# EAGLE design auto (EAGLE 9.2.2)
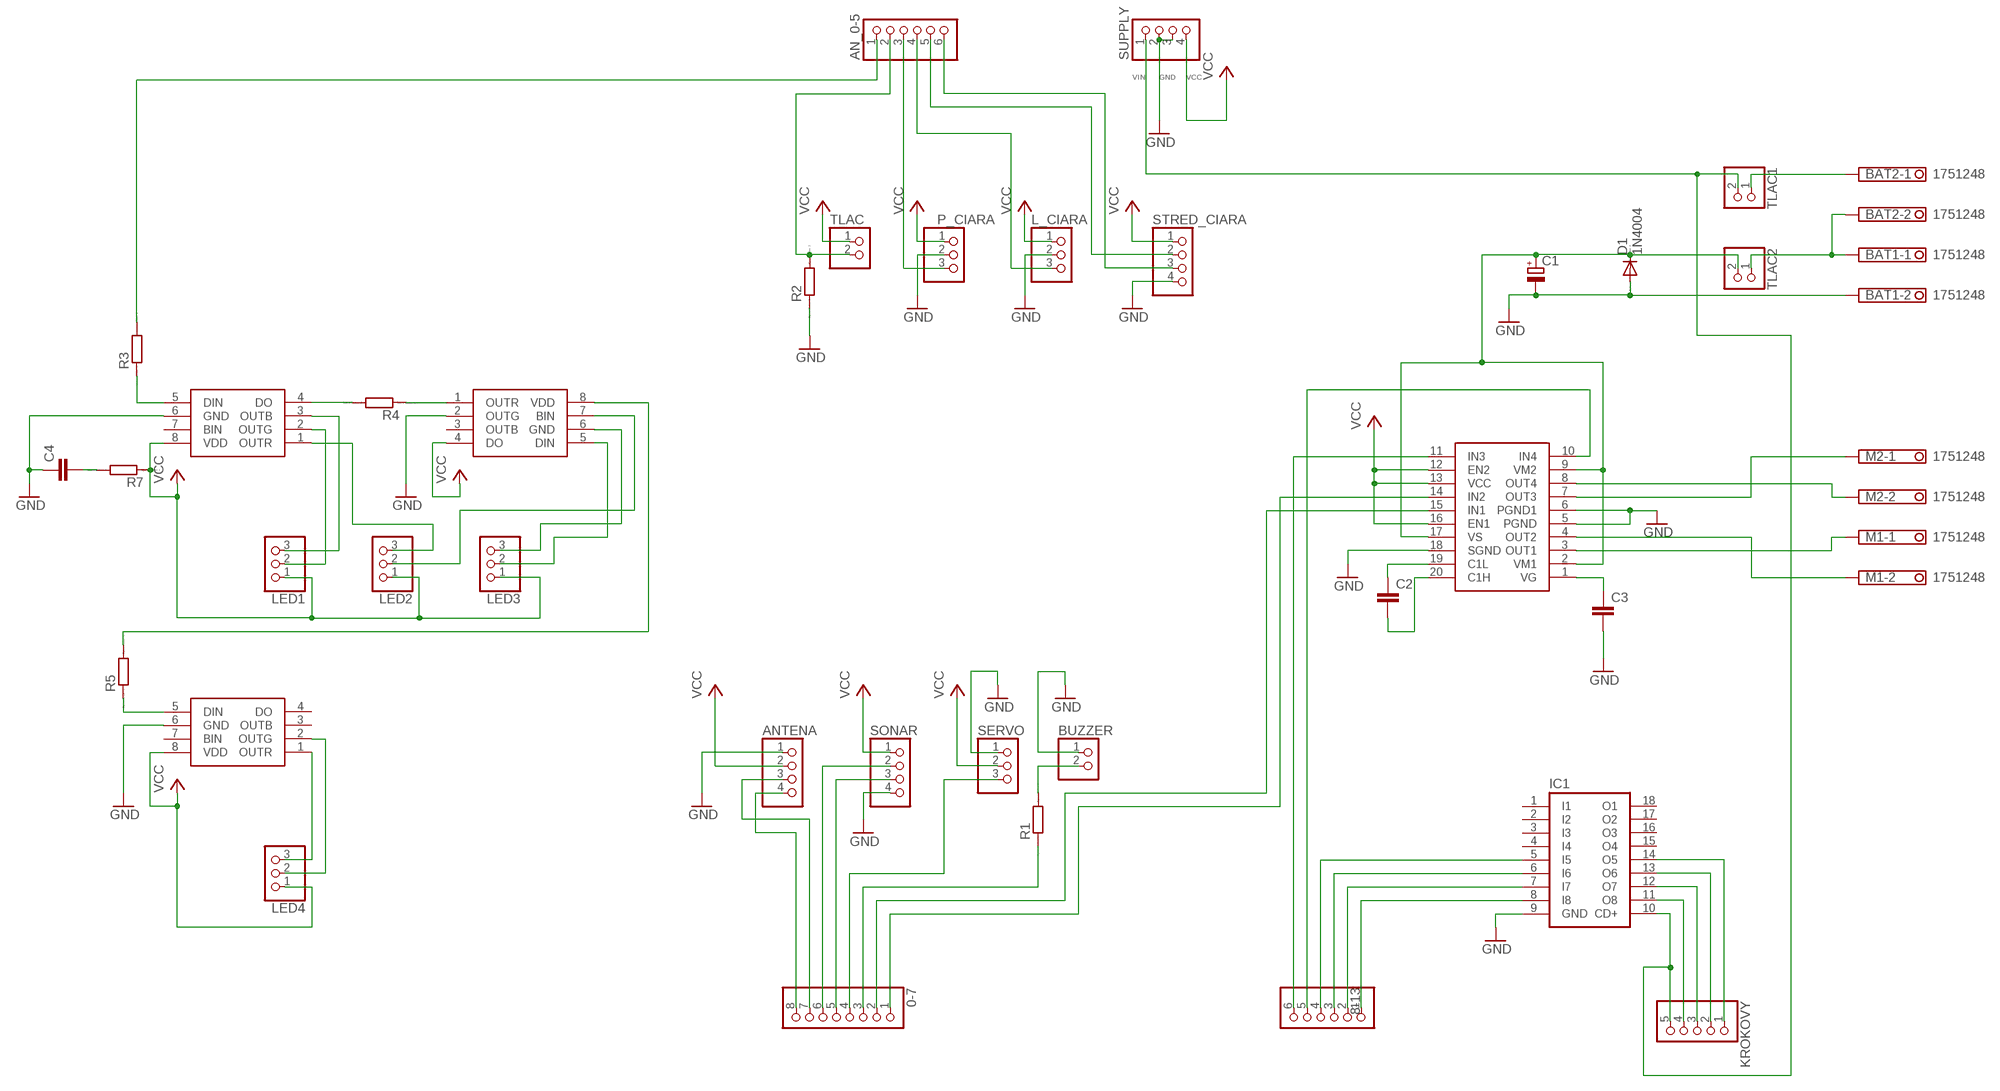
[diagram p0: schematic, sheet 1]

## Parts
0-7  PINHD-1X8  [1X08]
8-13  PINHD-1X6  [1X06]
AN_0-5  PINHD-1X6  [1X06]
ANTENA  PINHD-1X4  [1X04]
BAT1  1751248  [1751248]
BAT2  1751248  [1751248]
BUZZER  PINHD-1X2  [1X02]
C1  CPOL-EUE3.5-8  [E3,5-8]
C2  C-EU050-024X044  [C050-024X044]
C3  C-EU050-024X044  [C050-024X044]
C4  C-EU050-024X044  [C050-024X044]
D1  1N4004  [DO41-10]
IC1  ULN2804A  [DIL18]
KROKOVY  PINHD-1X5  [1X05]
L_CIARA  PINHD-1X3  [1X03]
LED1  PINHD-1X3  [1X03]
LED2  PINHD-1X3  [1X03]
LED3  PINHD-1X3  [1X03]
LED4  PINHD-1X3  [1X03]
M1  1751248  [1751248]
M2  1751248  [1751248]
P_CIARA  PINHD-1X3  [1X03]
R1  R0207/10  [0207/10]
R2  R0207/10  [0207/10]
R3  R0207/10  [0207/10]
R4  R0207/10  [0207/10]
R5  R0207/10  [0207/10]
R7  R0207/10  [0207/10]
SERVO  PINHD-1X3  [1X03]
SONAR  PINHD-1X4  [1X04]
STRED_CIARA  PINHD-1X4  [1X04]
SUPPLY  PINHD-1X4  [1X04]
TLAC  PINHD-1X2  [1X02]
TLAC1  PINHD-1X2  [1X02]
TLAC2  PINHD-1X2  [1X02]
U$1  LV8406  [TSSOP20]
U$2  WS2518B  [SOP08]
U$3  WS2518B  [SOP08]
U$4  WS2518B  [SOP08]

## Nets
GND: ANTENA.1 BAT1.2 BUZZER.1 C1.- C3.2 C4.1 D1.A IC1.9(GND) L_CIARA.2 P_CIARA.2 R2.1 SERVO.1 SONAR.4 STRED_CIARA.4 SUPPLY.2 SUPPLY.3 U$1.5(PGND) U$1.6(PGND1) U$1.18(SGND) U$2.6(GND) U$3.2(OUTG) U$4.6(GND)
N$1: AN_0-5.6 STRED_CIARA.3
N$2: AN_0-5.5 STRED_CIARA.2
N$3: AN_0-5.4 L_CIARA.3
N$4: AN_0-5.3 P_CIARA.3
N$5: 0-7.6 SONAR.2
N$6: 0-7.5 SONAR.3
N$7: 0-7.4 SERVO.3
N$8: C3.1 U$1.1(VG)
N$9: BAT1.1 BAT2.2 TLAC2.1
N$10: BUZZER.2 R1.2
N$11: 0-7.3 R1.1
N$12: BAT2.1 TLAC1.1
N$13: 8-13.4 IC1.5(I5)
N$14: 8-13.3 IC1.6(I6)
N$15: 8-13.2 IC1.7(I7)
N$16: 8-13.1 IC1.8(I8)
N$17: M1.1 U$1.3(OUT1)
N$18: IC1.11(O8) KROKOVY.4
N$19: IC1.12(O7) KROKOVY.3
N$20: IC1.14(O5) KROKOVY.1
N$21: IC1.13(O6) KROKOVY.2
N$22: M1.2 U$1.4(OUT2)
N$23: M2.1 U$1.7(OUT3)
N$24: M2.2 U$1.8(OUT4)
N$25: C1.+ D1.C TLAC2.2 U$1.2(VM1) U$1.9(VM2) U$1.17(VS)
N$26: 8-13.5 U$1.10(IN4)
N$27: 8-13.6 U$1.11(IN3)
N$28: C2.1 U$1.19(C1L)
N$29: C2.2 U$1.20(C1H)
N$30: R5.1 U$4.5(DIN)
N$31: LED4.3 U$4.1(OUTR)
N$32: 0-7.1 U$1.14(IN2)
N$33: R5.2 U$3.8(VDD)
N$34: AN_0-5.1 R3.2
N$35: LED2.2 U$3.7(BIN)
N$36: LED1.3 U$2.3(OUTB)
N$37: LED4.2 U$4.2(OUTG)
N$39: R4.1 U$3.1(OUTR)
N$40: R3.1 U$2.5(DIN)
N$41: LED3.3 U$3.6(GND)
N$42: LED3.2 U$3.5(DIN)
N$43: AN_0-5.2 R2.2 TLAC.2
N$46: 0-7.2 U$1.15(IN1)
N$47: LED1.2 U$2.2(OUTG)
N$48: 0-7.7 ANTENA.3
N$49: 0-7.8 ANTENA.4
N$50: R4.2 U$2.4(DO)
N$51: LED2.3 U$2.1(OUTR)
N$53: C4.2 R7.2
VCC: ANTENA.2 L_CIARA.1 LED1.1 LED2.1 LED3.1 LED4.1 P_CIARA.1 R7.1 SERVO.2 SONAR.1 STRED_CIARA.1 SUPPLY.4 TLAC.1 U$1.12(EN2) U$1.13(VCC) U$1.16(EN1) U$2.8(VDD) U$3.4(DO) U$4.8(VDD)
VIN: IC1.10(CD+) KROKOVY.5 SUPPLY.1 TLAC1.2
Unconnected: IC1.1(I1) IC1.2(I2) IC1.3(I3) IC1.4(I4) IC1.15(O4) IC1.16(O3) IC1.17(O2) IC1.18(O1) U$2.7(BIN) U$3.3(OUTB) U$4.3(OUTB) U$4.4(DO) U$4.7(BIN)

## Library data of the parts
0-7 = pinhead:PINHD-1X8: PIN HEADER
8-13 AN_0-5 = pinhead:PINHD-1X6: PIN HEADER
ANTENA SONAR STRED_CIARA SUPPLY = pinhead:PINHD-1X4: PIN HEADER
BAT1 BAT2 M1 M2 = con-phoenix-350:1751248: MKDS 1/ 2-3,5 Printklemme Nennstrom: 10 A Bemessungsspannung: 160 V Raster: 3,5 mm Polzahl: 2 Montageart: Löten Anschlussart: Schraubanschluss Anschlussrichtung vom Leiter zur Platine: 0° Source: http://eshop.phoenixcontact.com .. 1751248.pdf; OC_FARNELL: unknown; OC_NEWARK: unknown
BUZZER TLAC TLAC1 TLAC2 = pinhead:PINHD-1X2: PIN HEADER
C1 = rcl:CPOL-EU: POLARIZED CAPACITOR, European symbol; SPICEPREFIX: C
C2-C4 = rcl:C-EU: CAPACITOR, European symbol; SPICEPREFIX: C
D1 = diode:1N4004: DIODE general purpose rectifier, 1 A
IC1 = uln-udn:ULN2804A: DRIVER ARRAY
KROKOVY = pinhead:PINHD-1X5: PIN HEADER
L_CIARA LED1-LED4 P_CIARA SERVO = pinhead:PINHD-1X3: PIN HEADER
R1-R5 R7 = eagle-ltspice:R: RESISTOR, European symbol; SPICEMODEL: NONE; SPICEPREFIX: R
U$1 = LV8406:LV8406
U$2-U$4 = WS2518B:WS2518B

## Board
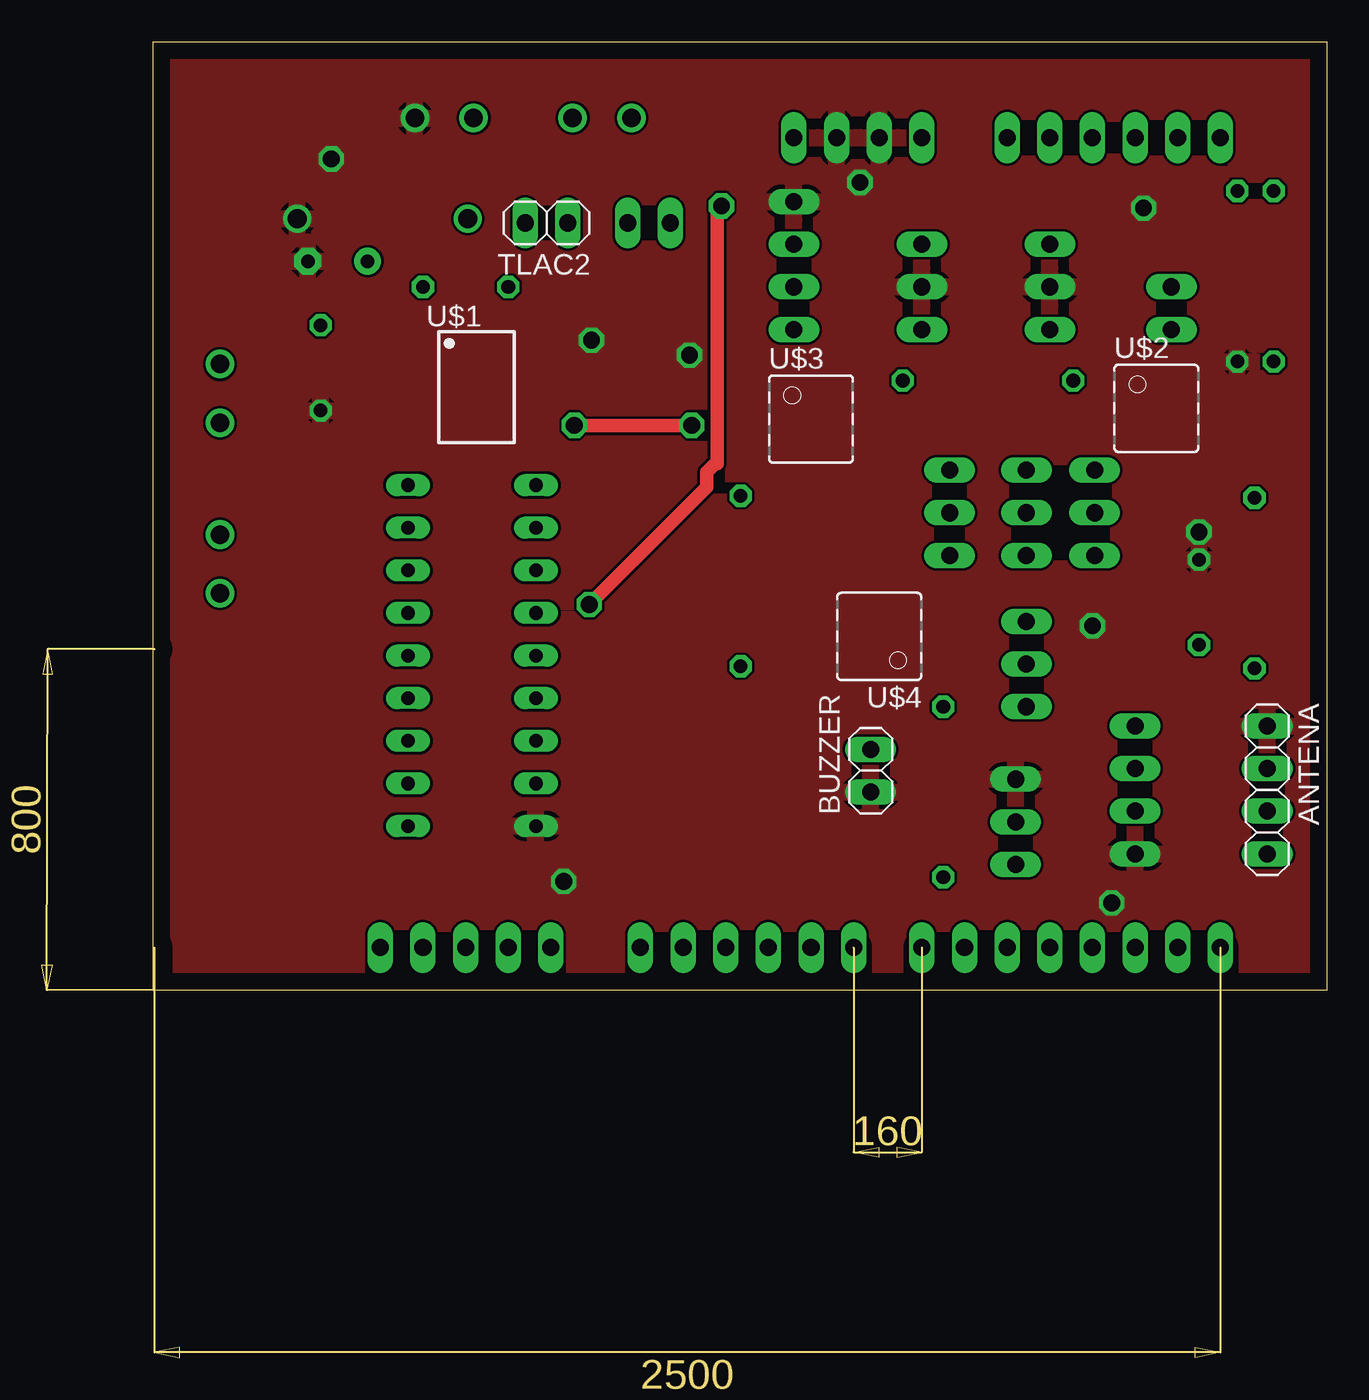
[diagram p1: board, top side]
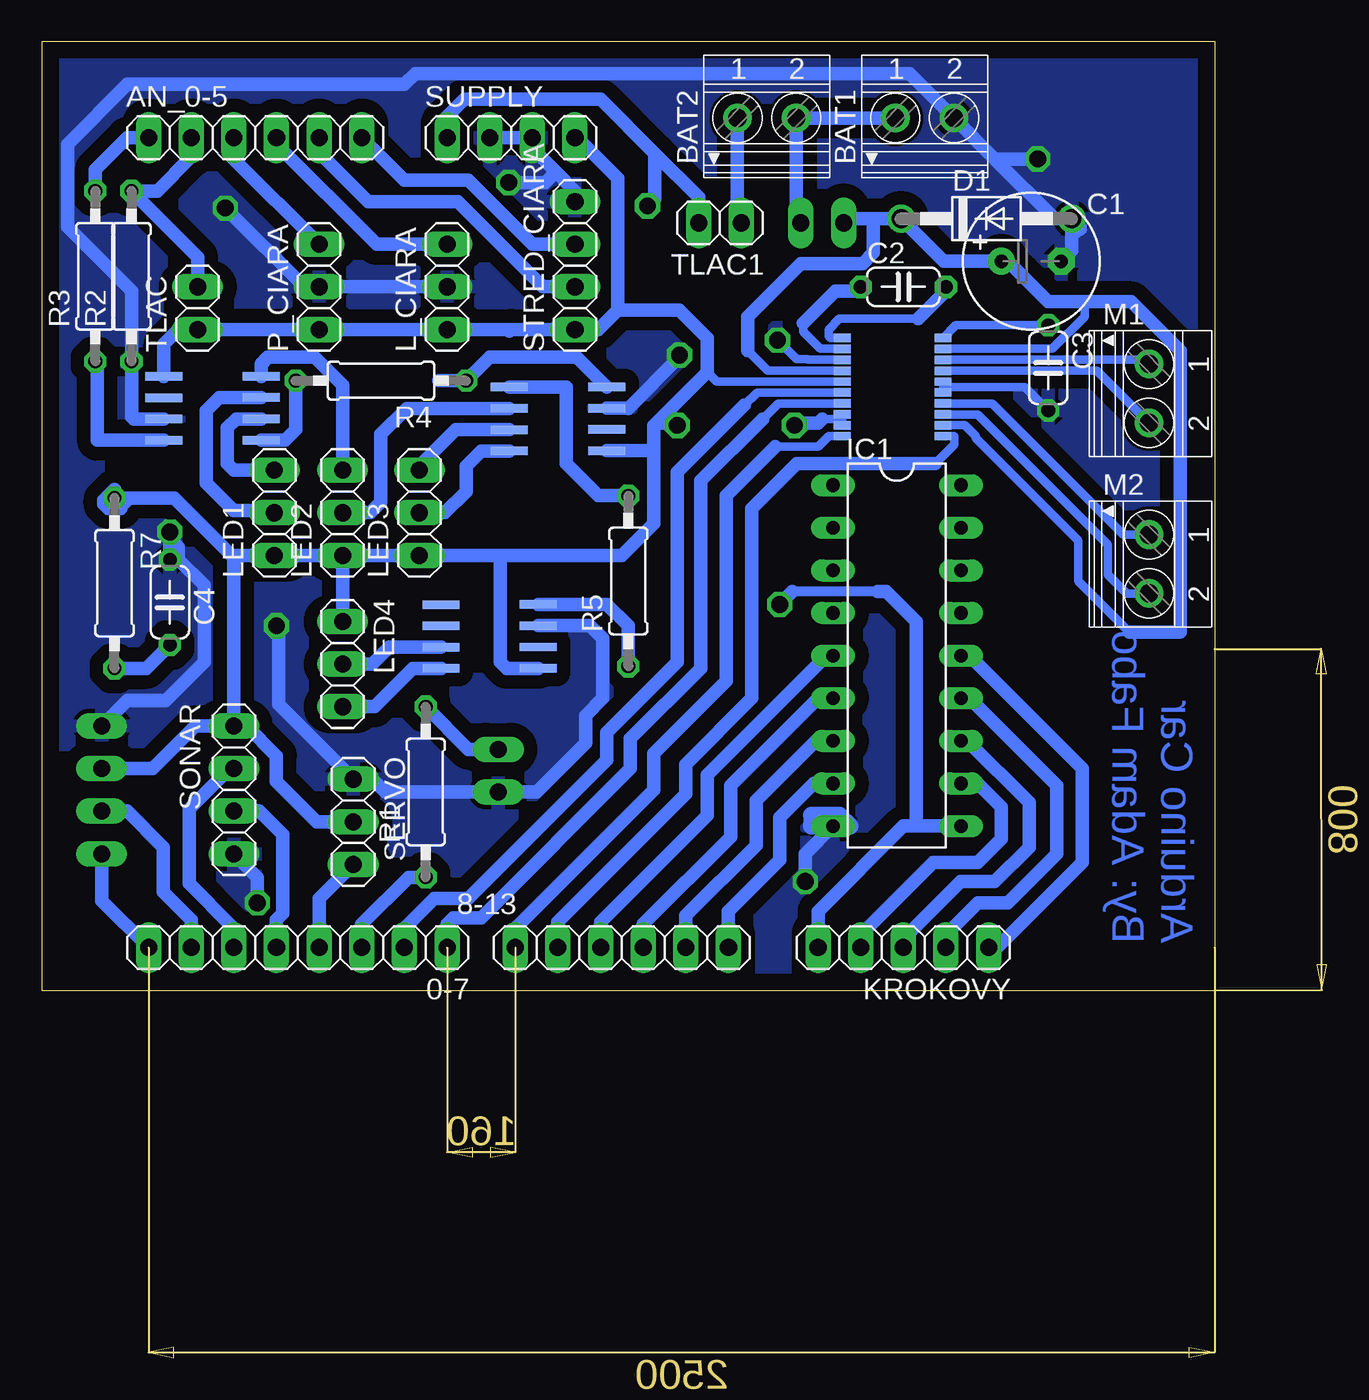
[diagram p2: board, bottom side, seen from below]

Size 69.9 x 56.51 mm. Coordinates in mm from the lower left corner, seen from the top.
Outline: 69.9,0 0,0 0,56.51 69.9,56.51 69.9,0
Copper layers (1*16): Top 0.035mm / dielectric 1.5mm / Bottom 0.035mm
Design rules "default": minimum track width 6mil, minimum drill 0.35mm, track to track 6mil, track to pad 6mil, pad to pad 6mil, via to via 6mil, smd to smd 6mil, copper to edge 40mil, drill to drill 6mil, minimum pad ring 10mil, minimum via ring 8mil, stop-mask expansion 4mil, vias tented up to drill 0mil, thermal gap 10mil

### Footprints (pad centres in the part's own frame; a part is rotated, then mirrored left to right if it is on the bottom)
1X08 = drill 1.016 long: 1 -8.89,0; 2 -6.35,0; 3 -3.81,0; 4 -1.27,0; 5 1.27,0; 6 3.81,0; 7 6.35,0; 8 8.89,0
1X06 = drill 1.016 long: 1 -6.35,0; 2 -3.81,0; 3 -1.27,0; 4 1.27,0; 5 3.81,0; 6 6.35,0
1X04 = drill 1.016 long: 1 -3.81,0; 2 -1.27,0; 3 1.27,0; 4 3.81,0
1751248 = drill 1.1 pad 1.7: 1 -1.75,-0.1; 2 1.75,-0.1
1X02 = drill 1.016 long: 1 -1.27,0; 2 1.27,0
E3,5-8 = drill 0.813 pad 1.6: + -1.778,0 | drill 0.813 pad 1.6 octagon: - 1.778,0
C050-024X044 = drill 0.813 octagon: 1 -2.54,0; 2 2.54,0
DO41-10 = drill 1.118: A 5.08,0; C -5.08,0
DIL18 = drill 0.813 long: 1 -10.16,-3.81; 2 -7.62,-3.81; 3 -5.08,-3.81; 4 -2.54,-3.81; 5 0,-3.81; 6 2.54,-3.81; 7 5.08,-3.81; 8 7.62,-3.81; 9 10.16,-3.81; 10 10.16,3.81; 11 7.62,3.81; 12 5.08,3.81; 13 2.54,3.81; 14 0,3.81; 15 -2.54,3.81; 16 -5.08,3.81; 17 -7.62,3.81; 18 -10.16,3.81
1X05 = drill 1.016 long: 1 -5.08,0; 2 -2.54,0; 3 0,0; 4 2.54,0; 5 5.08,0
1X03 = drill 1.016 long: 1 -2.54,0; 2 0,0; 3 2.54,0
0207/10 = drill 0.813 octagon: 1 -5.08,0; 2 5.08,0
TSSOP20 = smd 0.5 x 1 bottom: 1 -2.925,-3; 2 -2.275,-3; 3 -1.625,-3; 4 -0.975,-3; 5 -0.325,-3; 6 0.325,-3; 7 0.975,-3; 8 1.625,-3; 9 2.275,-3; 10 2.925,-3; 11 2.925,3; 12 2.275,3; 13 1.625,3; 14 0.975,3; 15 0.325,3; 16 -0.325,3; 17 -0.975,3; 18 -1.625,3; 19 -2.275,3; 20 -2.925,3
SOP08 = smd 0.5 x 2.2 bottom: 1 -1.905,-2.9; 2 -0.645,-2.9; 3 0.625,-2.9; 4 1.895,-2.9; 5 1.905,2.9; 6 0.635,2.9; 7 -0.635,2.9; 8 -1.905,2.9

### Placement (x,y rotation side)
0-7  54.66,2.54 180 bottom
8-13  35.36,2.54 180 bottom
AN_0-5  57.2,50.8 0 bottom
ANTENA  66.35,11.94 270 top
BAT1  17.32,52.07 0 bottom
BAT2  26.72,52.07 0 bottom
BUZZER  42.72,13.08 90 top
C1  10.97,43.43 0 bottom
C2  18.59,41.91 0 bottom
C3  9.96,37.08 270 bottom
C4  62.28,23.11 270 bottom
D1  13.64,45.97 0 bottom
IC1  18.97,19.94 270 bottom
KROKOVY  18.59,2.54 180 bottom
L_CIARA  45.77,41.91 90 bottom
LED1  56.06,28.45 90 bottom
LED2  51.99,28.45 90 bottom
LED3  47.42,28.45 90 bottom
LED4  51.99,19.43 270 bottom
M1  3.86,35.56 270 bottom
M2  3.86,25.4 270 bottom
P_CIARA  53.39,41.91 90 bottom
R1  47.04,11.81 90 bottom
R2  64.57,42.55 90 bottom
R3  66.73,42.55 90 bottom
R4  49.71,36.32 180 bottom
R5  34.98,24.38 90 bottom
R7  65.58,24.26 270 bottom
SERVO  51.36,10.03 270 bottom
SONAR  58.47,11.94 270 bottom
STRED_CIARA  38.15,43.18 90 bottom
SUPPLY  41.96,50.8 0 bottom
TLAC  60.63,40.64 90 bottom
TLAC1  29.52,45.72 180 bottom
TLAC2  23.42,45.72 180 top
U$1  19.23,35.94 270 top
U$2  59.74,34.67 270 top
U$3  39.17,34.04 270 top
U$4  43.23,21.08 90 top

### Tracks (layer width: path | path; a pad name or v marks a point on that pad's centre or on a via)
GND  (via drill 1 pad 0.75)
  Bottom 0.508: U$1.6 16.23,35.94 | 16.23,35.94 U$1.5 | 16.23,35.94 11.35,35.94 C3.2 | U$1.18 24.28,37.57 24.31,37.59 24.94,37.59 v26.09,38.73
  Bottom 0.813: SUPPLY.2 SUPPLY.3 40.69,50.16 39.29,48.77 | 39.29,48.77 38.15,47.62 STRED_CIARA.4 | 13.13,49.53 BAT1.2 18.21,54.61 47.68,54.61 48.31,53.98 64.82,53.98 68.38,50.42 68.38,45.47 64.57,41.66 R2.1 64.57,34.16 64.44,34.04 U$2.6 | 13.13,49.53 9.58,45.97 D1.A | D1.A 8.56,44.96 | 8.56,44.96 8.56,44.07 C1.- | 13.13,49.53 v10.59,49.53 | IC1.9 24.43,8.13 v24.43,6.48 | v55.93,21.72 55.8,21.59 55.8,17.02 SERVO.1 50.22,12.57 49.45,11.81 BUZZER.1 40.44,11.81 37.52,14.73 37.52,16.38 36.5,17.4 36.5,20.95 37.26,21.72 U$4.6 | SONAR.4 57.07,6.73 v57.07,5.21 | 39.29,48.77 39.93,48.13 v42.09,48.13 | 62.28,26.54 C4.1 61.77,25.65 | 62.28,26.54 v62.28,27.3 | ANTENA.1 64.82,17.27 62.53,17.27 60.25,19.56 60.25,24.13 61.77,25.65 | 61.77,25.65 61.77,26.42 61.9,26.54 62.28,26.54 | 8.05,45.47 D1.A | 8.05,45.47 8.05,45.34 8.56,45.85 D1.A | 8.05,45.47 8.56,44.96 | L_CIARA.2 P_CIARA.2 54.28,41.91 v58.98,46.61 | U$3.2 34.99,34.68 34.98,34.67 31.93,37.72 v31.93,37.85
  Bottom 1.016: 24.05,9.78 IC1.9 21.77,9.78 22.4,10.41 24.05,10.41 24.05,9.91
  pour Bottom (isolate 0.813): 0.05,56.52 69.9,56.52 69.9,0 0.05,0
  pour Top: 0.3,55.88 70.16,55.88 70.16,0 0.3,0
N$1
  Bottom 0.813: STRED_CIARA.3 40.69,44.45 44.5,48.26 48.31,48.26 AN_0-5.6
N$2
  Bottom 0.813: STRED_CIARA.2 40.06,41.91 45.14,46.99 50.47,46.99 53.39,49.91 AN_0-5.5
N$3
  Bottom 0.813: 55.93,50.16 AN_0-5.4 55.93,50.42 49.96,44.45 L_CIARA.3
N$4
  Bottom 0.813: P_CIARA.3 58.47,49.53 AN_0-5.3
N$5
  Bottom 0.813: 0-7.6 58.6,2.67 58.6,3.81 61.14,6.35 61.14,10.79 58.73,13.21 SONAR.2
N$6
  Bottom 0.813: 0-7.5 55.93,4.19 55.55,4.57 55.55,9.27 56.95,10.67 SONAR.3
N$7
  Bottom 0.813: 0-7.4 53.39,5.46 SERVO.3
N$8
  Bottom 0.508: U$1.1 15.47,39.62 C3.1
N$9
  Bottom 0.813: BAT1.1 BAT2.2 24.97,46 TLAC2.1
N$10
  Bottom 0.813: R1.2 44.5,14.35 BUZZER.2
N$11
  Bottom 0.813: 0-7.3 50.85,3.94 48.06,6.73 R1.1
N$12
  Bottom 0.813: 28.45,51.95 BAT2.1 28.47,45.95 TLAC1.1
N$13
  Bottom 0.813: 8-13.4 36.63,4.06 30.28,10.41 30.28,12.83 23.16,19.94 IC1.5
N$14
  Bottom 0.813: 8-13.3 34.09,3.94 28.88,9.14 28.88,12.19 23.67,17.4 IC1.6
N$15
  Bottom 0.813: 8-13.2 31.55,4.45 27.36,8.64 27.36,11.3 23.8,14.86 IC1.7
N$16
  Bottom 0.813: 8-13.1 29.01,4.7 25.96,7.75 25.96,10.29 23.93,12.32 IC1.8
N$17
  Bottom 0.508: M1.1 4.09,37.19 4.47,37.57 U$1.3
N$18
  Bottom 0.813: IC1.11 14.15,12.32 12.75,10.92 12.75,9.02 13.51,8.26 14.15,7.62 16.82,7.62 21.13,3.3 KROKOVY.4
N$19
  Bottom 0.813: IC1.12 14.78,14.86 11.1,11.18 11.1,8.51 13.13,6.48 15.16,6.48 18.59,3.05 KROKOVY.3
N$20
  Bottom 0.813: IC1.14 14.66,19.94 7.92,13.21 7.92,7.62 13,2.54 KROKOVY.1
N$21
  Bottom 0.813: IC1.13 14.66,17.4 9.45,12.19 9.45,8.13 12.37,5.21 14.15,5.21 16.05,3.3 KROKOVY.2
N$22
  Bottom 0.508: U$1.4 7.07,36.92 M1.2
N$23
  Bottom 0.508: M2.1 5.48,27.15 13.3,34.97 U$1.7
N$24
  Bottom 0.508: M2.2 5.29,23.65 6.4,24.77 6.4,26.54 14.15,34.29 16.2,34.29 U$1.8
N$25
  Bottom 0.508: 7.8,41.02 7.8,40.13 9.71,38.22 U$1.2 | 5.13,21.34 8.18,24.38 8.18,26.8 14.28,32.89 14.28,33.02 14.92,33.67 U$1.9 | U$1.17 26.68,36.92 27.86,38.1
  Bottom 0.813: 5.13,21.34 2.08,21.34 2.08,38.1 5,41.02 7.8,41.02 9.96,41.02 12.37,43.43 C1.+ 16.18,43.43 D1.C 20.37,45.97 | TLAC2.2 21.89,45.97 20.37,45.97 | 27.86,38.1 27.86,40.13 24.69,43.31 21.01,43.31 20.37,43.94 20.37,45.97
N$26
  Bottom 0.508: U$1.10 15.55,33.02 15.54,33.02 15.54,32.51 16.69,31.37
  Bottom 0.813: 8-13.5 39.17,4.06 31.55,11.68 31.55,13.46 27.61,17.4 27.61,28.7 24.94,31.37 16.69,31.37
N$27
  Bottom 0.508: U$1.11 23.04,33.02 23.67,32.38 26.21,32.38
  Bottom 0.813: 8-13.6 41.71,3.68 33.45,11.94 33.45,14.1 29.13,18.41 29.13,29.46 26.21,32.38
N$28
  Bottom 0.508: U$1.19 23.54,38.22 24.56,39.24 24.56,39.75
  Bottom 0.813: C2.1 21.39,41.66 22.66,41.66 24.56,39.75
N$29
  Bottom 0.508: U$1.20 22.91,38.87 23.04,38.99 23.04,39.37 22.4,40.01 17.7,40.01
  Bottom 0.813: C2.2 16.05,41.66 17.7,40.01
N$30
  Bottom 0.813: U$4.5 36.25,22.99 34.98,21.72 R5.1
N$31
  Bottom 0.813: U$4.1 47.8,19.18 50.09,16.89 LED4.3
N$32
  Bottom 0.508: U$1.14 26.04,34.97 26.98,34.04
  Bottom 0.813: 0-7.1 45.77,3.94 45.39,4.32 43.74,4.32 34.85,13.21 34.85,14.99 30.66,19.18 30.66,30.35 26.98,34.04
N$33
  Bottom 0.813: U$3.8 38.66,35.94 38.66,31.37 36.75,29.46 R5.2
N$34
  Bottom 0.813: R3.2 66.73,48.9 64.82,50.8 AN_0-5.1
N$35
  Bottom 0.813: LED2.2 50.34,28.45 49.71,29.08 49.71,33.15 48.18,34.67 U$3.7
N$36
  Bottom 0.813: LED1.3 58.47,30.99 58.85,31.37 58.85,33.53 58.33,34.05 U$2.3
N$37
  Bottom 0.813: U$4.2 49.19,20.44 49.2,20.45 50.22,19.43 LED4.2
N$39
  Bottom 0.813: 46.28,36.32 R4.1 43.23,37.72 38.05,37.72 U$3.1
N$40
  Bottom 0.813: R3.1 66.6,37.34 66.6,32.77 U$2.5
N$41
  Bottom 0.813: U$3.6 45.26,33.4 47.42,31.24 LED3.3
N$42
  Bottom 0.813: U$3.5 43.74,32.13 44.63,31.24 44.63,29.72 45.9,28.45 LED3.2
N$43
  Bottom 0.813: TLAC.2 60.63,43.69 R2.2 63.04,47.62 61.01,49.66 AN_0-5.2
N$46
  Bottom 0.508: U$1.15 27.3,35.62 28.05,34.86
  Bottom 0.813: 0-7.2 48.31,3.68 46.53,5.46 44.5,5.46 36.25,13.72 36.25,15.37 32.05,19.56 32.05,30.86 28.05,34.86
N$47
  Bottom 0.813: LED1.2 56.19,28.57 58.47,28.57 60.12,30.23 60.12,34.54 59.35,35.32 U$2.2
N$48
  Bottom 0.813: 0-7.7 61.01,4.19 62.66,5.84 62.66,8.51 64.82,10.67 ANTENA.3
N$49
  Bottom 0.813: 0-7.8 66.35,5.33 ANTENA.4
N$50
  Bottom 0.813: U$2.4 55.43,32.78 55.42,32.77 54.79,33.4 R4.2
N$51
  Bottom 0.813: U$2.1 56.84,37.32 56.44,37.72 53.65,37.72 51.99,36.07 LED2.3
N$53
  Bottom 0.813: R7.2 63.68,19.18 C4.2
VCC  (via drill 1 pad 0.75)
  Top 0.813: v25.07,33.66 v32.05,33.66
  Bottom 0.508: U$1.12 U$1.13 22.51,34.04 23.42,34.04 | 33.45,33.66 v32.05,33.66 | U$1.16 29.71,36.27 30.28,36.83
  Bottom 0.813: 57.84,15.75 SONAR.1 | 41.96,39.37 L_CIARA.1 P_CIARA.1 TLAC.1 61.77,39.37 62.64,38.5 U$2.8 | 41.96,39.37 STRED_CIARA.1 36.75,39.37 35.61,40.51 | SUPPLY.4 38.02,50.8 35.61,48.39 35.61,40.51 | 33.45,32.13 33.45,33.66 30.28,36.83 30.28,38.86 31.93,40.51 35.61,40.51 | LED2.1 LED3.1 42.6,25.91 | LED2.1 LED1.1 58.6,25.91 | 64.69,29.34 62.03,29.34 58.6,25.91 | 64.69,29.34 R7.1 65.56,29.36 65.56,29.84 65.58,29.84 66.22,29.21 66.22,28.96 65.96,28.7 65.2,28.7 65.2,28.83 64.69,29.34 | 58.6,25.91 58.34,25.65 58.47,25.53 SONAR.1 | LED4.1 LED2.1 | SERVO.2 53.52,10.03 55.93,12.45 55.93,13.97 57.71,15.75 SONAR.1 | ANTENA.2 63.3,13.21 60.76,15.75 SONAR.1 | v25.07,33.66 24.94,33.78 23.67,33.78 23.42,34.04 | 42.07,39.26 41.96,39.37 | U$3.4 33.46,32.14 33.45,32.13 | 42.6,25.91 35.36,25.91 33.45,27.81 33.45,32.13 | U$4.8 42.21,19.18 42.6,19.56 42.6,25.91
VIN  (via drill 1)
  Top 0.813: v25.96,22.99 32.94,29.97 32.94,30.86 33.45,31.37 33.58,31.37 33.58,46.48 v33.83,46.74
  Bottom 0.61: 20.12,23.75 25.2,23.75
  Bottom 0.813: KROKOVY.5 23.67,4.7 18.59,9.78 17.83,9.78 | 17.83,9.78 IC1.10 | 33.39,49.85 36.63,53.09 44.76,53.09 45.77,52.07 SUPPLY.1 | 33.39,49.85 33.39,47.18 v33.83,46.74 | 25.2,23.75 v25.96,22.99 | 17.83,9.78 17.83,21.97 19.61,23.75 20.12,23.75 | TLAC1.2 30.79,47.24 33.39,49.85

### Text on the board
Bottom: Arduino Car / By: Adam Fabo